# Altium schematic sheet 3 - IO Socket 1.SchDoc
size A4
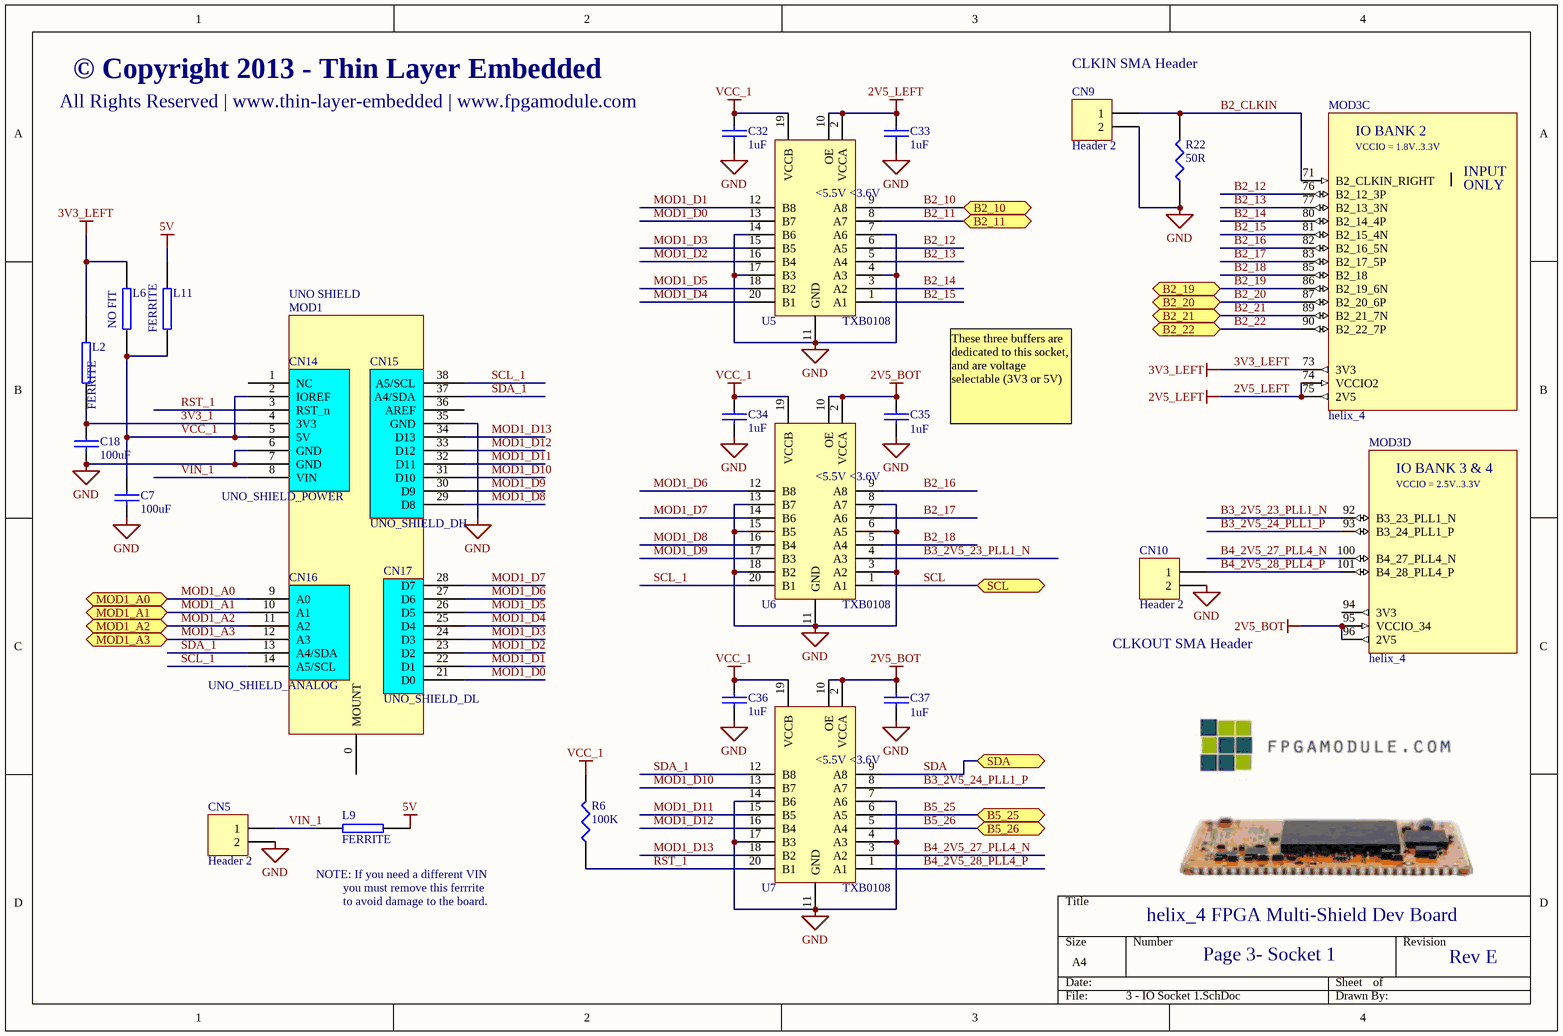
[diagram p0: 3 - IO Socket 1.SchDoc]

## Parts
C7  100uF  [1210]
C18  100uF  [1210]
C32  1uF  [0805]
C33  1uF  [0805]
C34  1uF  [0805]
C35  1uF  [0805]
C36  1uF  [0805]
C37  1uF  [0805]
CN5  Header 2  [HDR1X2]
CN9  Header 2  [SMA_V]
CN10  Header 2  [SMA_V]
CN14  UNO_SHIELD_POWER  [UNO_SHIELD_POWER]
CN15  UNO_SHIELD_DH  [UNO_SHIELD_DH]
CN16  UNO_SHIELD_ANALOG  [UNO_SHIELD_ANALOG]
CN17  UNO_SHIELD_DL  [UNO_SHIELD_DL]
L2  FERRITE  [0805]
L6  NO FIT  [0805]
L9  FERRITE  [0805]
L11  FERRITE  [0805]
MOD1  UNO SHIELD  [UNO_SHIELD_MECH]
MOD3  helix_4  [HELIX_4_LCC104_HOST]  (parts C,D of 7)
R6  100K  [0805]
R22  50R  [0805]
U5  TXB0108  [TSSOP20]
U6  TXB0108  [TSSOP20]
U7  TXB0108  [TSSOP20]

## Ports
B2_10, B2_11, B2_19, B2_20, B2_21, B2_22, B5_25, B5_26, MOD1_A0, MOD1_A1, MOD1_A2, MOD1_A3, SCL, SDA

## Nets
2V5_BOT: C35.2 C37.2 MOD3.95(VCCIO_34) MOD3.96(2V5) U6.2(VCCA) U6.10(OE) U7.2(VCCA) U7.10(OE)
2V5_LEFT: C33.2 MOD3.74(VCCIO2) MOD3.75(2V5) U5.2(VCCA) U5.10(OE)
3V3_LEFT: L2.1 L6.1 MOD3.73(3V3)
5V: L9.1 L11.1
GND: C7.2 C18.2 C32.1 C33.1 C34.1 C35.1 C36.1 C37.1 CN5.2 CN9.2 CN10.2 CN14.6(GND) CN14.7(GND) CN15.35(GND) R22.1 U5.4(A3) U5.7(A6) U5.11(GND) U5.14(B6) U5.17(B3) U6.3(A2) U6.6(A5) U6.8(A7) U6.11(GND) U6.13(B7) U6.15(B5) U6.18(B2) U7.4(A3) U7.7(A6) U7.11(GND) U7.14(B6) U7.17(B3)
VCC_1: C7.1 C32.2 C34.2 C36.2 CN14.2(IOREF) CN14.5(5V) L6.2 L11.2 R6.2 U5.19(VCCB) U6.19(VCCB) U7.19(VCCB)
3V3_1: C18.1 CN14.4(3V3) L2.2
B2_10: U5.9(A8) ; port B2_10
B2_11: U5.8(A7) ; port B2_11
B2_12: MOD3.76(B2_12_3P) U5.6(A5)
B2_13: MOD3.77(B2_13_3N) U5.5(A4)
B2_14: MOD3.80(B2_14_4P) U5.3(A2)
B2_15: MOD3.81(B2_15_4N) U5.1(A1)
B2_16: MOD3.82(B2_16_5N) U6.9(A8)
B2_17: MOD3.83(B2_17_5P) U6.7(A6)
B2_18: MOD3.85(B2_18) U6.5(A4)
B2_19: MOD3.86(B2_19_6N) ; port B2_19
B2_20: MOD3.87(B2_20_6P) ; port B2_20
B2_21: MOD3.89(B2_21_7N) ; port B2_21
B2_22: MOD3.90(B2_22_7P) ; port B2_22
B2_CLKIN: CN9.1 MOD3.71(B2_CLKIN_RIGHT) R22.2
B3_2V5_23_PLL1_N: MOD3.92(B3_23_PLL1_N) U6.4(A3)
B3_2V5_24_PLL1_P: MOD3.93(B3_24_PLL1_P) U7.8(A7)
B4_2V5_27_PLL4_N: MOD3.100(B4_27_PLL4_N) U7.3(A2)
B4_2V5_28_PLL4_P: CN10.1 MOD3.101(B4_28_PLL4_P) U7.1(A1)
B5_25: U7.6(A5) ; port B5_25
B5_26: U7.5(A4) ; port B5_26
MOD1_A0: CN16.9(A0) ; port MOD1_A0
MOD1_A1: CN16.10(A1) ; port MOD1_A1
MOD1_A2: CN16.11(A2) ; port MOD1_A2
MOD1_A3: CN16.12(A3) ; port MOD1_A3
MOD1_D0: CN17.21(D0) U5.13(B7)
MOD1_D1: CN17.22(D1) U5.12(B8)
MOD1_D2: CN17.23(D2) U5.16(B4)
MOD1_D3: CN17.24(D3) U5.15(B5)
MOD1_D4: CN17.25(D4) U5.20(B1)
MOD1_D5: CN17.26(D5) U5.18(B2)
MOD1_D6: CN17.27(D6) U6.12(B8)
MOD1_D7: CN17.28(D7) U6.14(B6)
MOD1_D8: CN15.29(D8) U6.16(B4)
MOD1_D9: CN15.30(D9) U6.17(B3)
MOD1_D10: CN15.31(D10) U7.13(B7)
MOD1_D11: CN15.32(D11) U7.15(B5)
MOD1_D12: CN15.33(D12) U7.16(B4)
MOD1_D13: CN15.34(D13) U7.18(B2)
RST_1: CN14.3(RST_n) R6.1 U7.20(B1)
SCL: U6.1(A1) ; port SCL
SCL_1: CN15.38(A5/SCL) CN16.14(A5/SCL) U6.20(B1)
SDA: U7.9(A8) ; port SDA
SDA_1: CN15.37(A4/SDA) CN16.13(A4/SDA) U7.12(B8)
VIN_1: CN5.1 CN14.8(VIN) L9.2

Not connected (* = marked no-connect by the designer): CN14 1(NC); CN15 36(AREF); MOD1 0(MOUNT); MOD3 94(3V3)

## Notes on the sheet
- (near C32) All Rights Reserved | www.thin-layer-embedded | www.fpgamodule.com
- © Copyright 2013 - Thin Layer Embedded
- (near CN9) CLKIN SMA Header
- These three buffers are dedicated to this socket, and are voltage selectable (3V3 or 5V)
- (near CN10) CLKOUT SMA Header
- (near L9) NOTE: If you need a different VIN
- you must remove this ferrrite
- to avoid damage to the board.
- helix_4 FPGA Multi-Shield Dev Board
- Page 3- Socket 1
- Rev E
- (in symbol helix_4 Rev C Module, part C) IO BANK 2; VCCIO = 1.8V..3.3V; INPUT; ONLY
- (in symbol helix_4 Rev C Module, part D) IO BANK 3 & 4; VCCIO = 2.5V..3.3V
- (in symbol TXB0108) <5.5V; <3.6V

## Library data of the parts
C7 C18 C32-C37 = CAP: Capacitor
CN5 CN9 CN10 = Header 2: Header, 2-Pin; LatestRevisionDate: 17-Jul-2002; LatestRevisionNote: Re-released for DXP Platform.; Publisher: Altium Limited
L6 = FERRITE
MOD1 = UNO_SHIELD_MECH
MOD3 = helix_4 Rev C Module
R6 R22 = RES1
U5-U7 = TXB0108: TI Bir-dir buffer